# EAGLE schematic STM32F446 front pane - northeast - v3 (EAGLE 9.6.2)

## Sheet 1 of 3
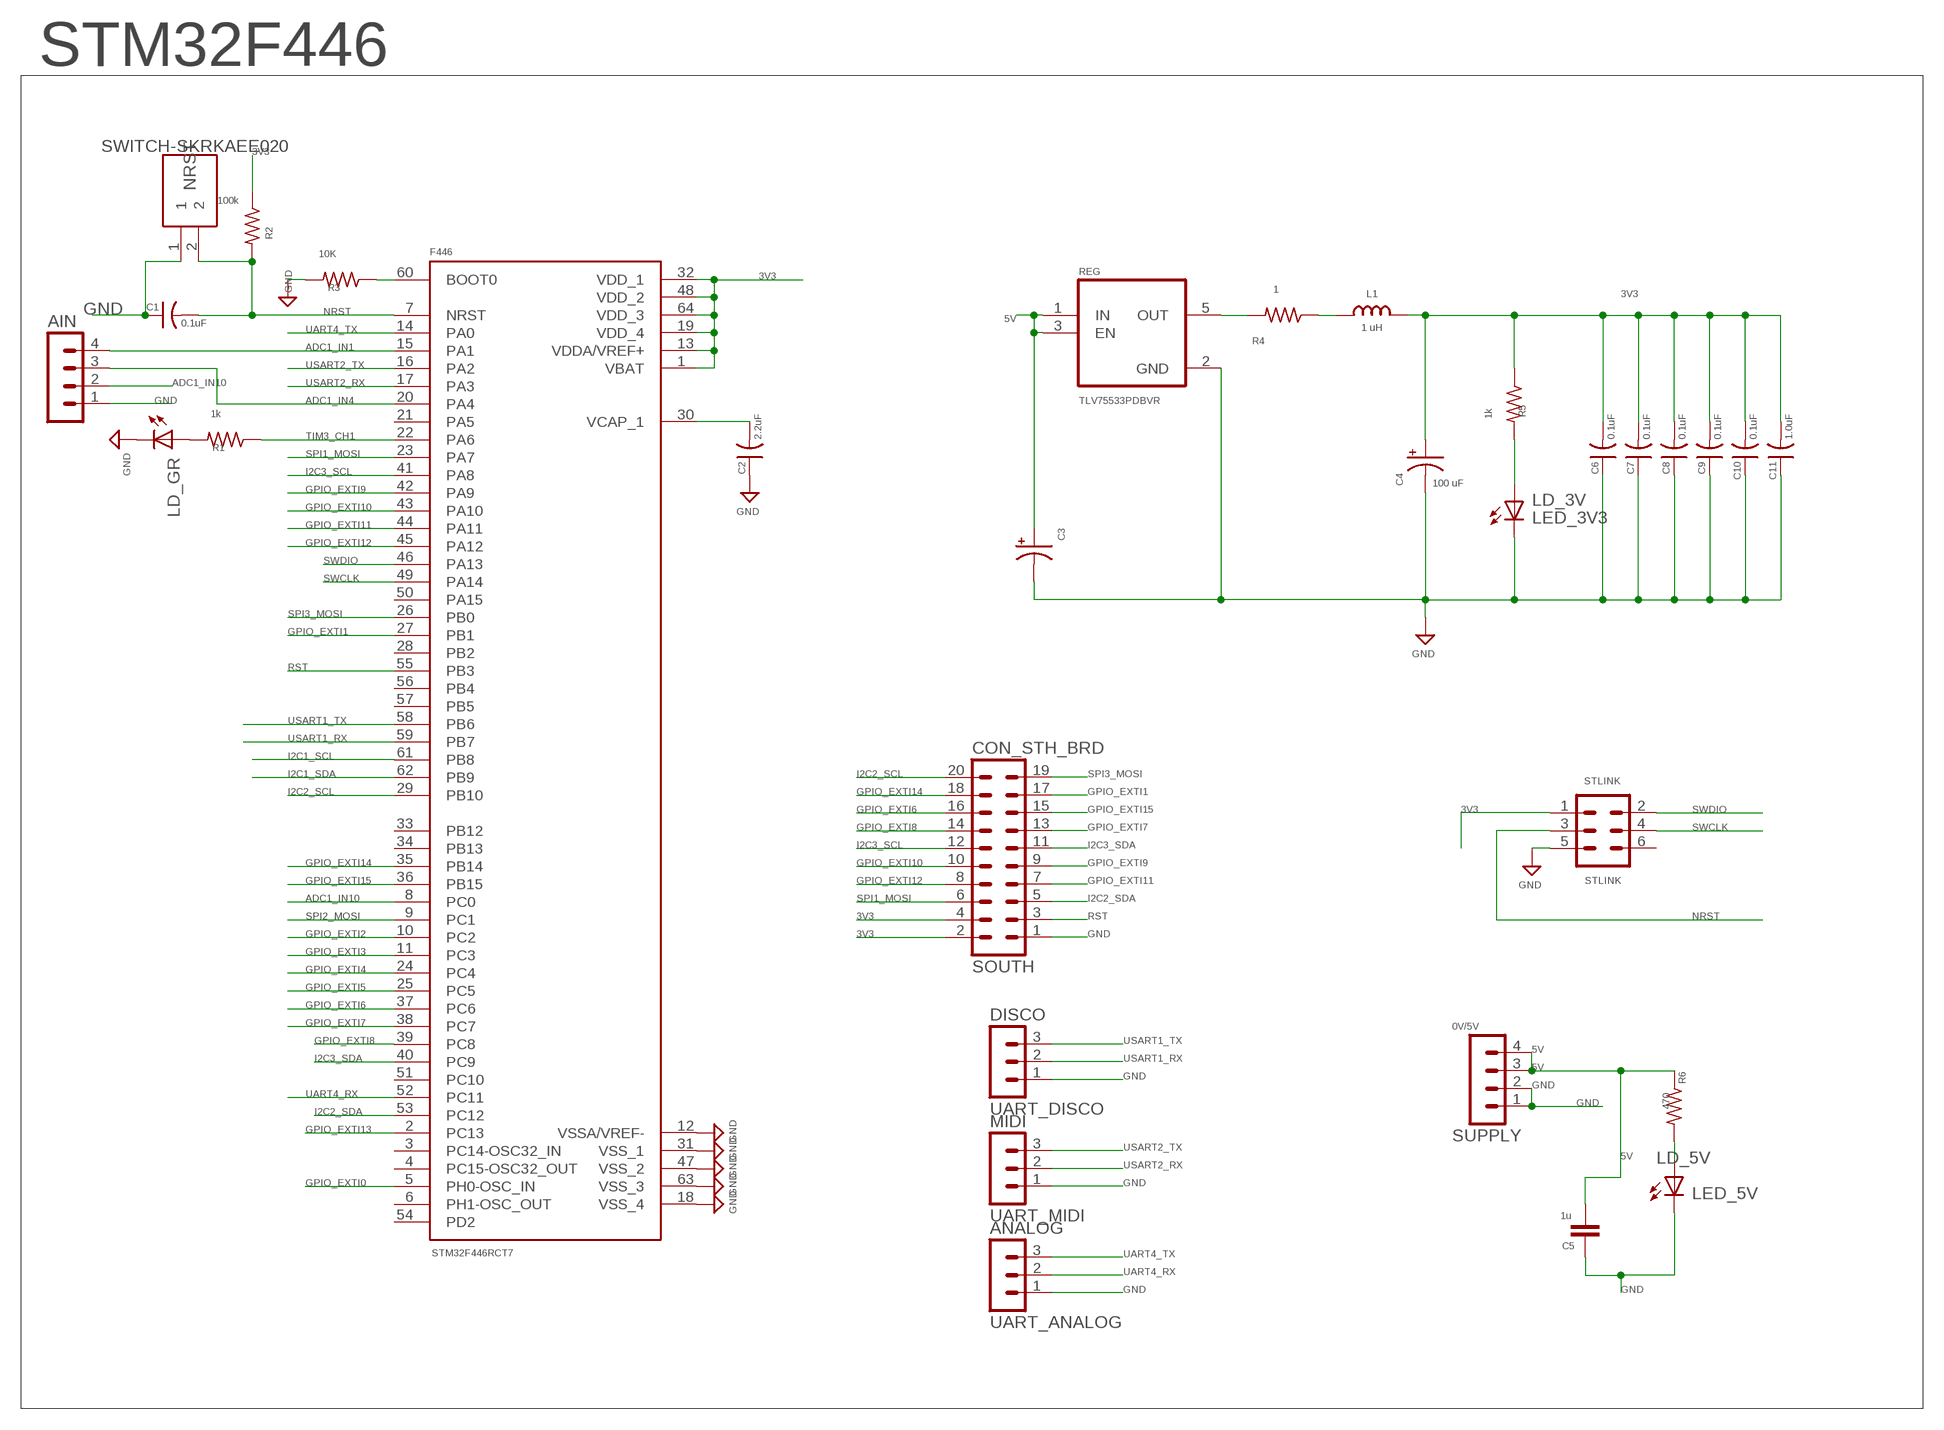
[diagram p0: schematic, sheet 1]

### Parts
0V/5V  SUPPLY  PINHEADER-M04PL  [MA04-1]
AIN  MA04-1  [MA04-1]
ANALOG  UART_ANALOG  MA03-1  [MA03-1]
C1  0.1uF  C-US0805  [C0805]
C2  2.2uF  C-US0805  [C0805]
C3  10u  CPOL-US2917  [CPOL2917]
C4  100 uF  CPOL-US2917  [CPOL2917]
C5  1u  C-EUC1206  [C1206]
C6  0.1uF  C-US0805  [C0805]
C7  0.1uF  C-US0805  [C0805]
C8  0.1uF  C-US0805  [C0805]
C9  0.1uF  C-US0805  [C0805]
C10  0.1uF  C-US0805  [C0805]
C11  1.0uF  C-US0805  [C0805]
CON_STH_BRD  SOUTH  MA10-2  [MA10-2]
DISCO  UART_DISCO  MA03-1  [MA03-1]
F446  STM32F446RCT7  [QFP50P1200X1200X160-64N]
L1  1 uH  L-USL0805  [L0805]
LD_3V  LED_3V3  LED-0805  [0805-LED]
LD_5V  LED_5V  LED-0603  [0603-LED]
LD_GR  LED-0805  [0805-LED]
MIDI  UART_MIDI  MA03-1  [MA03-1]
NRST  SWITCH-SKRKAEE020  [SKRKAEE020]
R1  1k  R-US0805  [R0805]
R2  100k  R-US0805  [R0805]
R3  10K  R-US0805  [R0805]
R4  1  R-US0805  [R0805]
R5  1k  R-US0805  [R0805]
R6  470  R-US0805  [R0805]
REG  TLV75533PDBVR  [SOT95P280X145-5N]
STLINK  STLINK  MA03-2  [MA03-2]

### Nets
3V3: C4.+ C6.2 C7.2 C8.2 C9.2 C10.2 C11.2 CON_STH_BRD.2 CON_STH_BRD.4 F446.1(VBAT) F446.13(VDDA/VREF+) F446.19(VDD_4) F446.32(VDD_1) F446.48(VDD_2) F446.64(VDD_3) L1.2 R2.1 R5.1 STLINK.1 ; also sheet 2,3
5V: 0V/5V.3 0V/5V.4 C3.+ C5.2 R6.1 REG.1(IN) REG.3(EN)
ADC1_IN1: AIN.4 F446.15(PA1)
ADC1_IN4: AIN.3 F446.20(PA4)
ADC1_IN10: AIN.2 F446.8(PC0)
BOOT1: F446.60(BOOT0) R3.1
GND: 0V/5V.1 0V/5V.2 AIN.1 ANALOG.1 C1.1 C2.1 C3.- C4.- C5.1 C6.1 C7.1 C8.1 C9.1 C10.1 C11.1 CON_STH_BRD.1 DISCO.1 F446.12(VSSA/VREF-) F446.18(VSS_4) F446.31(VSS_1) F446.47(VSS_2) F446.63(VSS_3) LD_3V.C LD_5V.C LD_GR.C MIDI.1 NRST.1 R3.2 REG.2(GND) STLINK.5 ; also sheet 2,3
GPIO_EXTI0: F446.5(PH0-OSC_IN) ; also sheet 3
GPIO_EXTI1: CON_STH_BRD.17 F446.27(PB1)
GPIO_EXTI2: F446.10(PC2) ; also sheet 3
GPIO_EXTI3: F446.11(PC3) ; also sheet 3
GPIO_EXTI4: F446.24(PC4) ; also sheet 2
GPIO_EXTI5: F446.25(PC5) ; also sheet 2
GPIO_EXTI6: CON_STH_BRD.16 F446.37(PC6)
GPIO_EXTI7: CON_STH_BRD.13 F446.38(PC7)
GPIO_EXTI8: CON_STH_BRD.14 F446.39(PC8)
GPIO_EXTI9: CON_STH_BRD.9 F446.42(PA9)
GPIO_EXTI10: CON_STH_BRD.10 F446.43(PA10)
GPIO_EXTI11: CON_STH_BRD.7 F446.44(PA11)
GPIO_EXTI12: CON_STH_BRD.8 F446.45(PA12)
GPIO_EXTI13: F446.2(PC13) ; also sheet 3
GPIO_EXTI14: CON_STH_BRD.18 F446.35(PB14)
GPIO_EXTI15: CON_STH_BRD.15 F446.36(PB15)
I2C1_SCL: F446.61(PB8) ; also sheet 2,3
I2C1_SDA: F446.62(PB9) ; also sheet 2,3
I2C2_SCL: CON_STH_BRD.20 F446.29(PB10)
I2C2_SDA: CON_STH_BRD.5 F446.53(PC12)
I2C3_SCL: CON_STH_BRD.12 F446.41(PA8)
I2C3_SDA: CON_STH_BRD.11 F446.40(PC9)
N$53: LD_5V.A R6.2
N$56: LD_GR.A R1.2
N$57: LD_3V.A R5.2
N$108: R4.2 REG.5(OUT)
N$109: L1.1 R4.1
NRST: C1.2 F446.7(NRST) NRST.2 R2.2 STLINK.3
RST: CON_STH_BRD.3 F446.55(PB3) ; also sheet 2,3
SPI1_MOSI: CON_STH_BRD.6 F446.23(PA7)
SPI2_MOSI: F446.9(PC1) ; also sheet 2
SPI3_MOSI: CON_STH_BRD.19 F446.26(PB0)
SWCLK: F446.49(PA14) STLINK.4
SWDIO: F446.46(PA13) STLINK.2
TIM3_CH1: F446.22(PA6) R1.1
UART4_RX: ANALOG.2 F446.52(PC11)
UART4_TX: ANALOG.3 F446.14(PA0)
USART1_RX: DISCO.2 F446.59(PB7)
USART1_TX: DISCO.3 F446.58(PB6)
USART2_RX: F446.17(PA3) MIDI.2
USART2_TX: F446.16(PA2) MIDI.3
VCAP1: C2.2 F446.30(VCAP_1)
Unconnected: F446.3(PC14-OSC32_IN) F446.4(PC15-OSC32_OUT) F446.6(PH1-OSC_OUT) F446.21(PA5) F446.28(PB2) F446.33(PB12) F446.34(PB13) F446.50(PA15) F446.51(PC10) F446.54(PD2) F446.56(PB4) F446.57(PB5) STLINK.6

### Notes on the sheet
- STM32F446

## Sheet 2 of 3
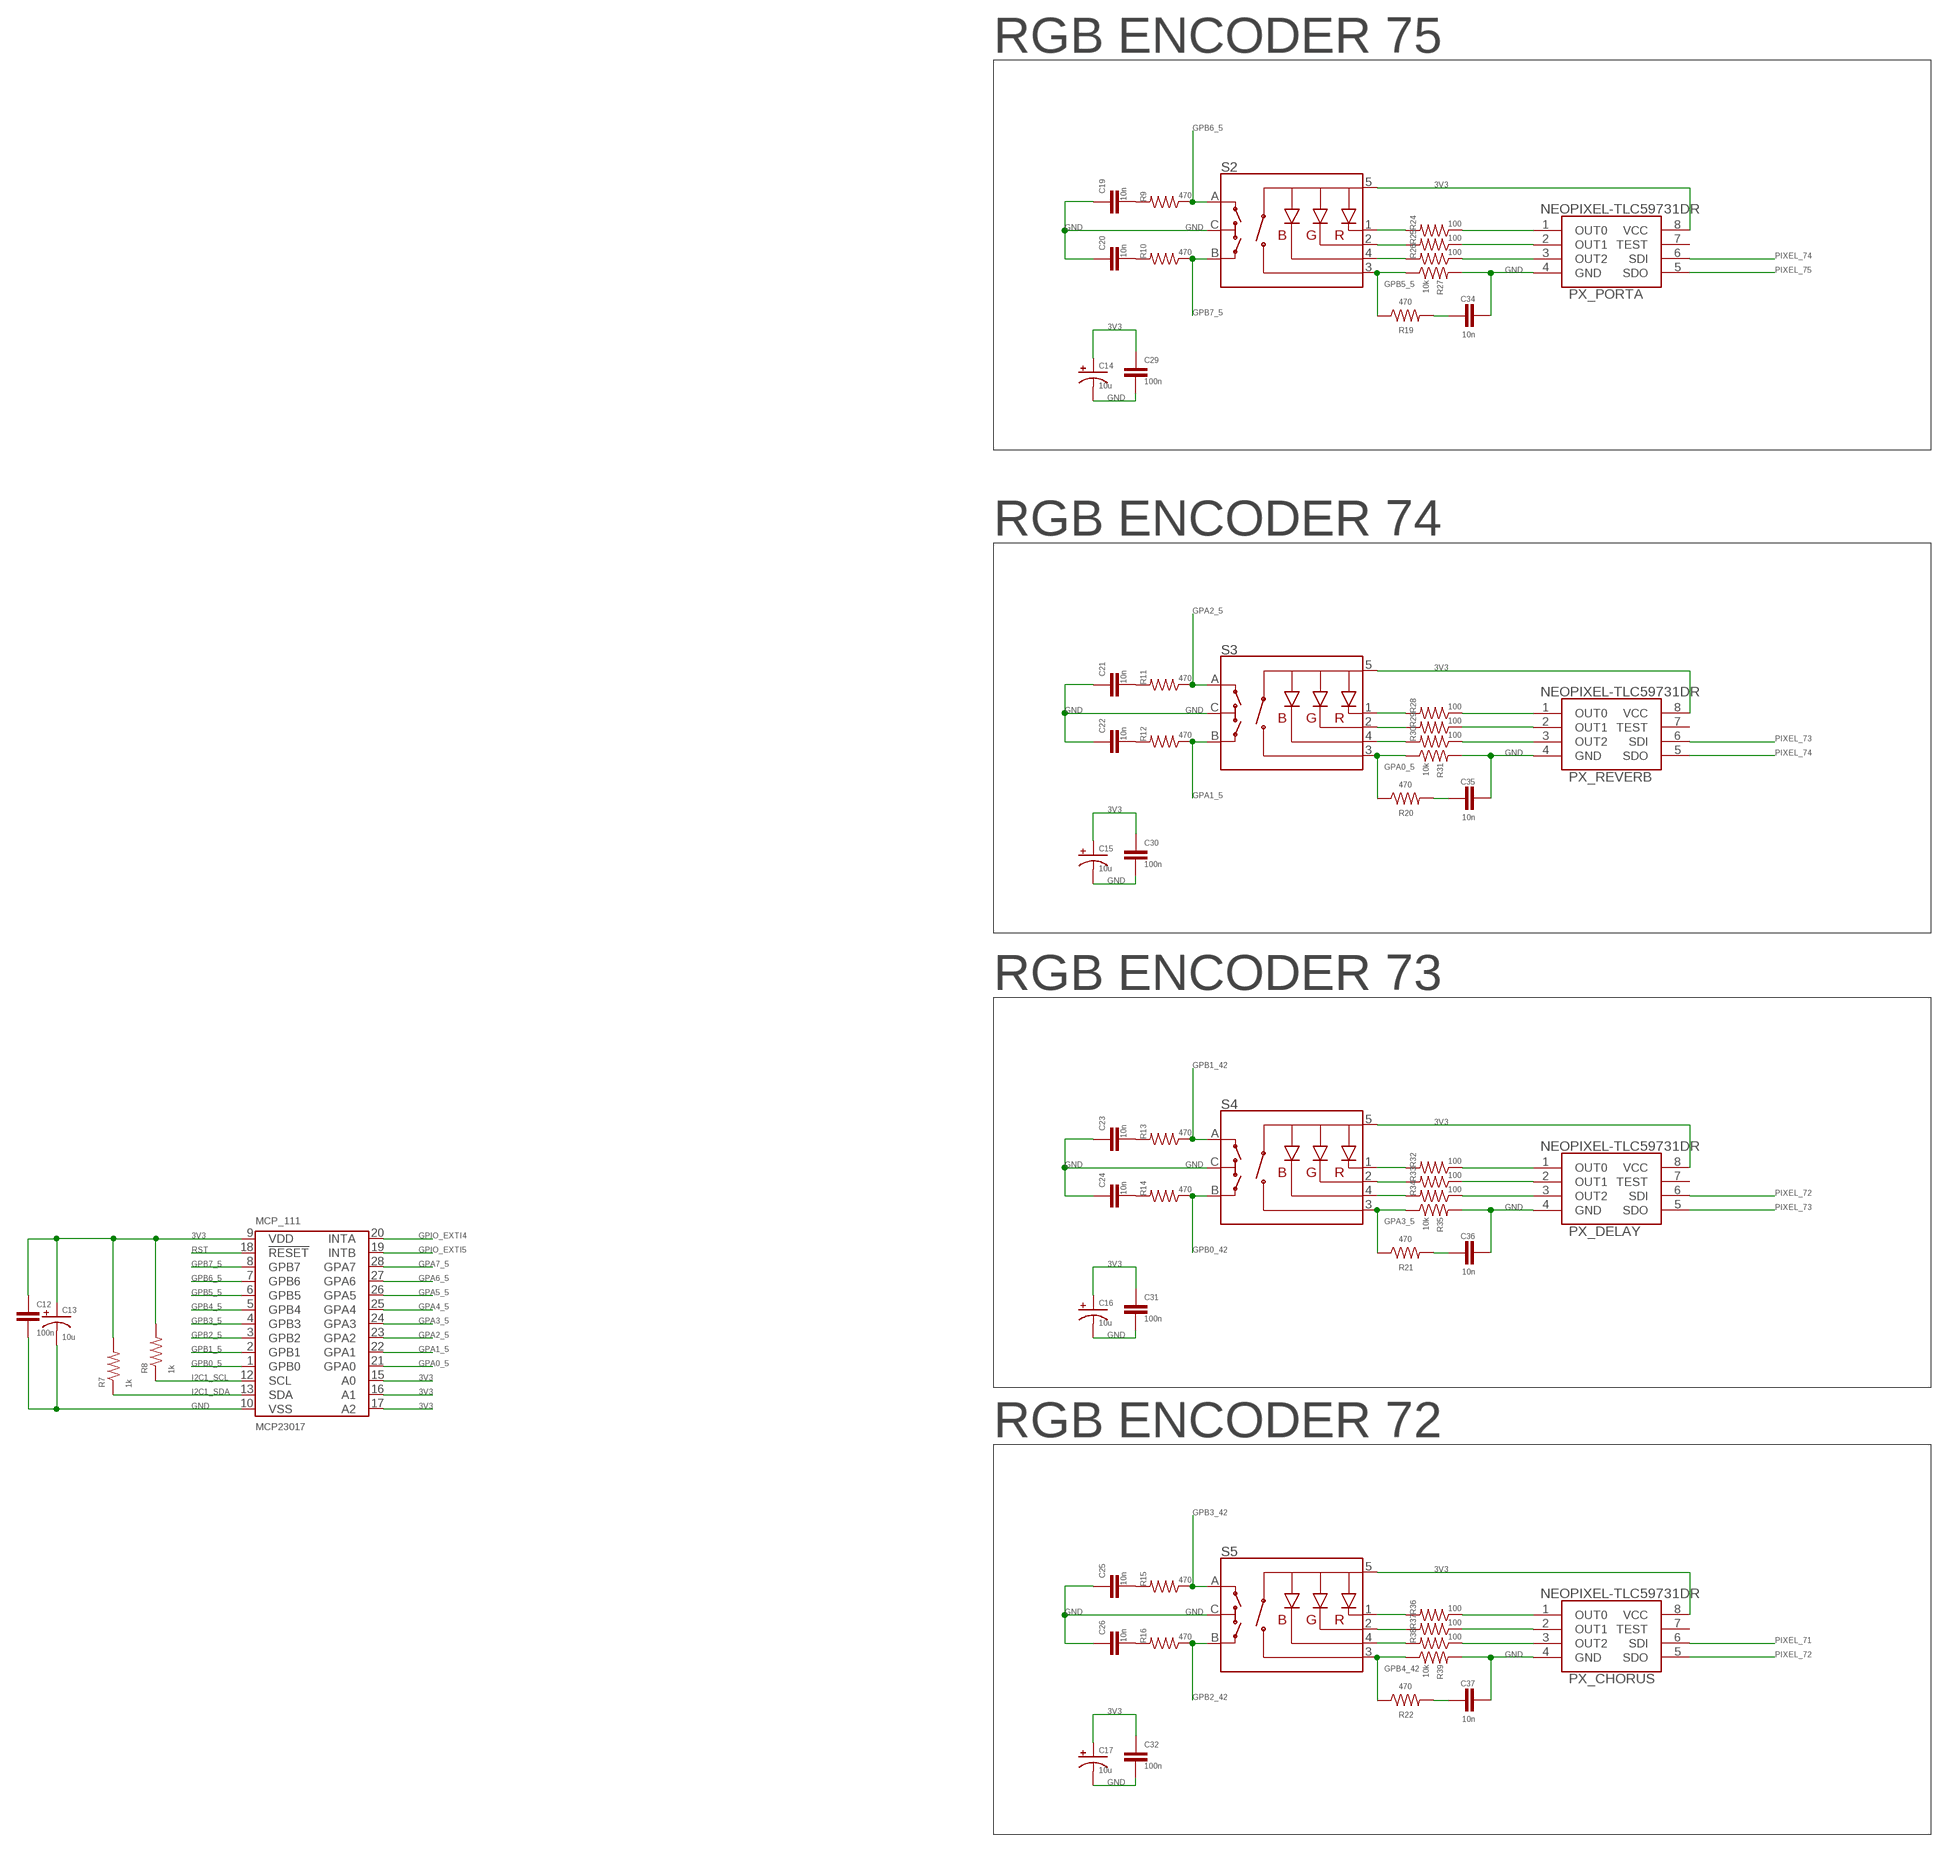
[diagram p1: schematic, sheet 2, part 1 of 2]
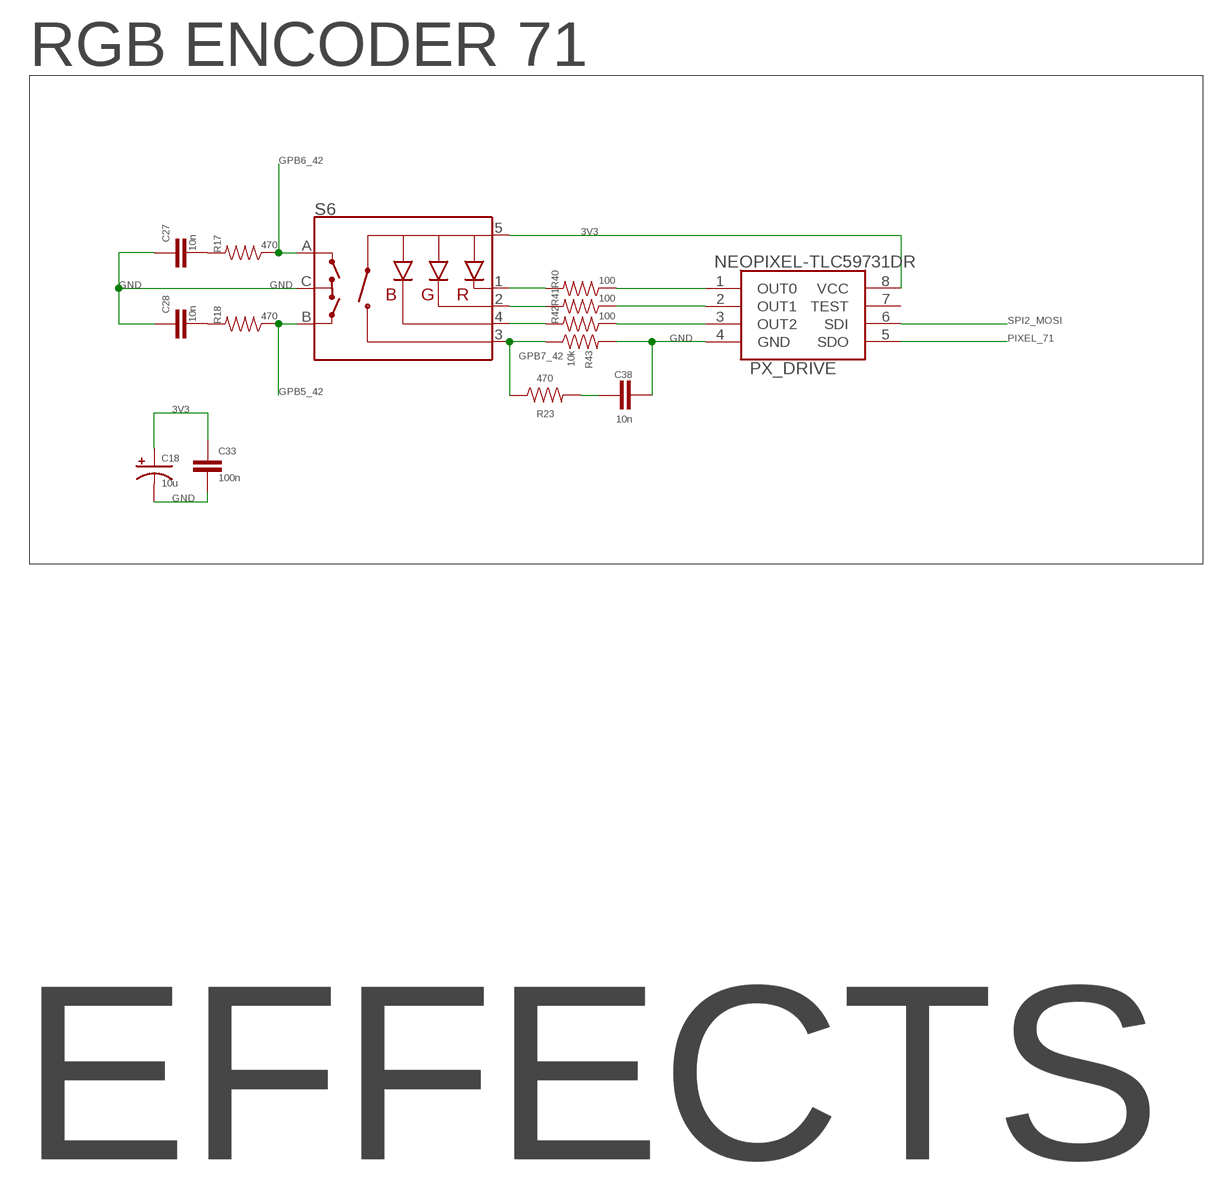
[diagram p2: schematic, sheet 2, part 2 of 2]

### Parts
C12  100n  PASSIF-CAP-0805  [0805-CAP]
C13  10u  PASSIF-CPOL-US2917  [CPOL2917]
C14  10u  PASSIF-CPOL-US2917  [CPOL2917]
C15  10u  PASSIF-CPOL-US2917  [CPOL2917]
C16  10u  PASSIF-CPOL-US2917  [CPOL2917]
C17  10u  PASSIF-CPOL-US2917  [CPOL2917]
C18  10u  PASSIF-CPOL-US2917  [CPOL2917]
C19  10n  PASSIF-CAP-0805  [0805-CAP]
C20  10n  PASSIF-CAP-0805  [0805-CAP]
C21  10n  PASSIF-CAP-0805  [0805-CAP]
C22  10n  PASSIF-CAP-0805  [0805-CAP]
C23  10n  PASSIF-CAP-0805  [0805-CAP]
C24  10n  PASSIF-CAP-0805  [0805-CAP]
C25  10n  PASSIF-CAP-0805  [0805-CAP]
C26  10n  PASSIF-CAP-0805  [0805-CAP]
C27  10n  PASSIF-CAP-0805  [0805-CAP]
C28  10n  PASSIF-CAP-0805  [0805-CAP]
C29  100n  PASSIF-CAP-0805  [0805-CAP]
C30  100n  PASSIF-CAP-0805  [0805-CAP]
C31  100n  PASSIF-CAP-0805  [0805-CAP]
C32  100n  PASSIF-CAP-0805  [0805-CAP]
C33  100n  PASSIF-CAP-0805  [0805-CAP]
C34  10n  PASSIF-CAP-0805  [0805-CAP]
C35  10n  PASSIF-CAP-0805  [0805-CAP]
C36  10n  PASSIF-CAP-0805  [0805-CAP]
C37  10n  PASSIF-CAP-0805  [0805-CAP]
C38  10n  PASSIF-CAP-0805  [0805-CAP]
MCP_111  MCP23017  [SOIC-28]
PX_CHORUS  NEOPIXEL-TLC59731DR  [SOIC127P600X175-8N]
PX_DELAY  NEOPIXEL-TLC59731DR  [SOIC127P600X175-8N]
PX_DRIVE  NEOPIXEL-TLC59731DR  [SOIC127P600X175-8N]
PX_PORTA  NEOPIXEL-TLC59731DR  [SOIC127P600X175-8N]
PX_REVERB  NEOPIXEL-TLC59731DR  [SOIC127P600X175-8N]
R7  1k  R-US_R0805  [R0805]
R8  1k  R-US_R0805  [R0805]
R9  470  PASSIF-RESISTOR-1206  [1206]
R10  470  PASSIF-RESISTOR-1206  [1206]
R11  470  PASSIF-RESISTOR-1206  [1206]
R12  470  PASSIF-RESISTOR-1206  [1206]
R13  470  PASSIF-RESISTOR-1206  [1206]
R14  470  PASSIF-RESISTOR-1206  [1206]
R15  470  PASSIF-RESISTOR-1206  [1206]
R16  470  PASSIF-RESISTOR-1206  [1206]
R17  470  PASSIF-RESISTOR-1206  [1206]
R18  470  PASSIF-RESISTOR-1206  [1206]
R19  470  PASSIF-RESISTOR-1206  [1206]
R20  470  PASSIF-RESISTOR-1206  [1206]
R21  470  PASSIF-RESISTOR-1206  [1206]
R22  470  PASSIF-RESISTOR-1206  [1206]
R23  470  PASSIF-RESISTOR-1206  [1206]
R24  100  PASSIF-RESISTOR-1206  [1206]
R25  100  PASSIF-RESISTOR-1206  [1206]
R26  100  PASSIF-RESISTOR-1206  [1206]
R27  10k  PASSIF-RESISTOR-1206  [1206]
R28  100  PASSIF-RESISTOR-1206  [1206]
R29  100  PASSIF-RESISTOR-1206  [1206]
R30  100  PASSIF-RESISTOR-1206  [1206]
R31  10k  PASSIF-RESISTOR-1206  [1206]
R32  100  PASSIF-RESISTOR-1206  [1206]
R33  100  PASSIF-RESISTOR-1206  [1206]
R34  100  PASSIF-RESISTOR-1206  [1206]
R35  10k  PASSIF-RESISTOR-1206  [1206]
R36  100  PASSIF-RESISTOR-1206  [1206]
R37  100  PASSIF-RESISTOR-1206  [1206]
R38  100  PASSIF-RESISTOR-1206  [1206]
R39  10k  PASSIF-RESISTOR-1206  [1206]
R40  100  PASSIF-RESISTOR-1206  [1206]
R41  100  PASSIF-RESISTOR-1206  [1206]
R42  100  PASSIF-RESISTOR-1206  [1206]
R43  10k  PASSIF-RESISTOR-1206  [1206]
S2  ENCODER-RGB-SWITCH-NO_NUT  [ENCODER_LED_3]
S3  ENCODER-RGB-SWITCH-NO_NUT  [ENCODER_LED_3]
S4  ENCODER-RGB-SWITCH-NO_NUT  [ENCODER_LED_3]
S5  ENCODER-RGB-SWITCH-NO_NUT  [ENCODER_LED_3]
S6  ENCODER-RGB-SWITCH-NO_NUT  [ENCODER_LED_3]

### Nets
3V3: C12.1 C13.+ C14.+ C15.+ C16.+ C17.+ C18.+ C29.1 C30.1 C31.1 C32.1 C33.1 MCP_111.9(VDD) MCP_111.15(A0) MCP_111.16(A1) MCP_111.17(A2) PX_CHORUS.8(VCC) PX_DELAY.8(VCC) PX_DRIVE.8(VCC) PX_PORTA.8(VCC) PX_REVERB.8(VCC) R7.2 R8.2 S2.5(+) S3.5(+) S4.5(+) S5.5(+) S6.5(+) ; also sheet 1,3
GND: C12.2 C13.- C14.- C15.- C16.- C17.- C18.- C19.1 C20.1 C21.1 C22.1 C23.1 C24.1 C25.1 C26.1 C27.1 C28.1 C29.2 C30.2 C31.2 C32.2 C33.2 C34.2 C35.2 C36.2 C37.2 C38.2 MCP_111.10(VSS) PX_CHORUS.4(GND) PX_DELAY.4(GND) PX_DRIVE.4(GND) PX_PORTA.4(GND) PX_REVERB.4(GND) R27.2 R31.2 R35.2 R39.2 R43.2 S2.C S3.C S4.C S5.C S6.C ; also sheet 1,3
GPA0_5: MCP_111.21(GPA0) R20.1 R31.1 S3.3(SW)
GPA1_5: MCP_111.22(GPA1) R12.1 S3.B
GPA2_5: MCP_111.23(GPA2) R11.1 S3.A
GPA3_5: MCP_111.24(GPA3) R21.1 R35.1 S4.3(SW)
GPA4_5: MCP_111.25(GPA4) ; also sheet 3
GPA5_5: MCP_111.26(GPA5) ; also sheet 3
GPA6_5: MCP_111.27(GPA6) ; also sheet 3
GPA7_5: MCP_111.28(GPA7) ; also sheet 3
GPB0_5: MCP_111.1(GPB0) ; also sheet 3
GPB0_42: R14.1 S4.B ; also sheet 3
GPB1_5: MCP_111.2(GPB1) ; also sheet 3
GPB1_42: R13.1 S4.A ; also sheet 3
GPB2_5: MCP_111.3(GPB2) ; also sheet 3
GPB2_42: R16.1 S5.B ; also sheet 3
GPB3_5: MCP_111.4(GPB3) ; also sheet 3
GPB3_42: R15.1 S5.A ; also sheet 3
GPB4_5: MCP_111.5(GPB4) ; also sheet 3
GPB4_42: R22.1 R39.1 S5.3(SW) ; also sheet 3
GPB5_5: MCP_111.6(GPB5) R19.1 R27.1 S2.3(SW)
GPB5_42: R18.1 S6.B ; also sheet 3
GPB6_5: MCP_111.7(GPB6) R9.1 S2.A
GPB6_42: R17.1 S6.A ; also sheet 3
GPB7_5: MCP_111.8(GPB7) R10.1 S2.B
GPB7_42: R23.1 R43.1 S6.3(SW) ; also sheet 3
GPIO_EXTI4: MCP_111.20(INTA) ; also sheet 1
GPIO_EXTI5: MCP_111.19(INTB) ; also sheet 1
I2C1_SCL: MCP_111.12(SCL) R8.1 ; also sheet 1,3
I2C1_SDA: MCP_111.13(SDA) R7.1 ; also sheet 1,3
N$5416: R40.2 S6.1(-R)
N$5417: R41.2 S6.2(-G)
N$5418: R42.2 S6.4(-B)
N$5419: PX_DRIVE.1(OUT0) R40.1
N$5420: PX_DRIVE.2(OUT1) R41.1
N$5421: PX_DRIVE.3(OUT2) R42.1
N$5422: C27.2 R17.2
N$5423: C28.2 R18.2
N$5424: C38.1 R23.2
N$6880: R36.2 S5.1(-R)
N$6881: R37.2 S5.2(-G)
N$6882: R38.2 S5.4(-B)
N$6883: PX_CHORUS.1(OUT0) R36.1
N$6884: PX_CHORUS.2(OUT1) R37.1
N$6885: PX_CHORUS.3(OUT2) R38.1
N$6886: C25.2 R15.2
N$6887: C26.2 R16.2
N$6888: C37.1 R22.2
N$8344: R32.2 S4.1(-R)
N$8345: R33.2 S4.2(-G)
N$8346: R34.2 S4.4(-B)
N$8347: PX_DELAY.1(OUT0) R32.1
N$8348: PX_DELAY.2(OUT1) R33.1
N$8349: PX_DELAY.3(OUT2) R34.1
N$8350: C23.2 R13.2
N$8351: C24.2 R14.2
N$8352: C36.1 R21.2
N$9076: R28.2 S3.1(-R)
N$9077: R29.2 S3.2(-G)
N$9078: R30.2 S3.4(-B)
N$9079: PX_REVERB.1(OUT0) R28.1
N$9080: PX_REVERB.2(OUT1) R29.1
N$9081: PX_REVERB.3(OUT2) R30.1
N$9082: C21.2 R11.2
N$9083: C22.2 R12.2
N$9084: C35.1 R20.2
N$9442: R24.2 S2.1(-R)
N$9443: R25.2 S2.2(-G)
N$9444: R26.2 S2.4(-B)
N$9445: PX_PORTA.1(OUT0) R24.1
N$9446: PX_PORTA.2(OUT1) R25.1
N$9447: PX_PORTA.3(OUT2) R26.1
N$9448: C19.2 R9.2
N$9449: C20.2 R10.2
N$9450: C34.1 R19.2
PIXEL_71: PX_CHORUS.6(SDI) PX_DRIVE.5(SDO)
PIXEL_72: PX_CHORUS.5(SDO) PX_DELAY.6(SDI)
PIXEL_73: PX_DELAY.5(SDO) PX_REVERB.6(SDI)
PIXEL_74: PX_PORTA.6(SDI) PX_REVERB.5(SDO)
PIXEL_75: PX_PORTA.5(SDO) ; also sheet 3
RST: MCP_111.18(!RESET) ; also sheet 1,3
SPI2_MOSI: PX_DRIVE.6(SDI) ; also sheet 1
Unconnected: PX_CHORUS.7(TEST) PX_DELAY.7(TEST) PX_DRIVE.7(TEST) PX_PORTA.7(TEST) PX_REVERB.7(TEST)

### Notes on the sheet
- RGB ENCODER 75
- RGB ENCODER 74
- RGB ENCODER 73
- RGB ENCODER 72
- RGB ENCODER 71
- EFFECTS

## Sheet 3 of 3
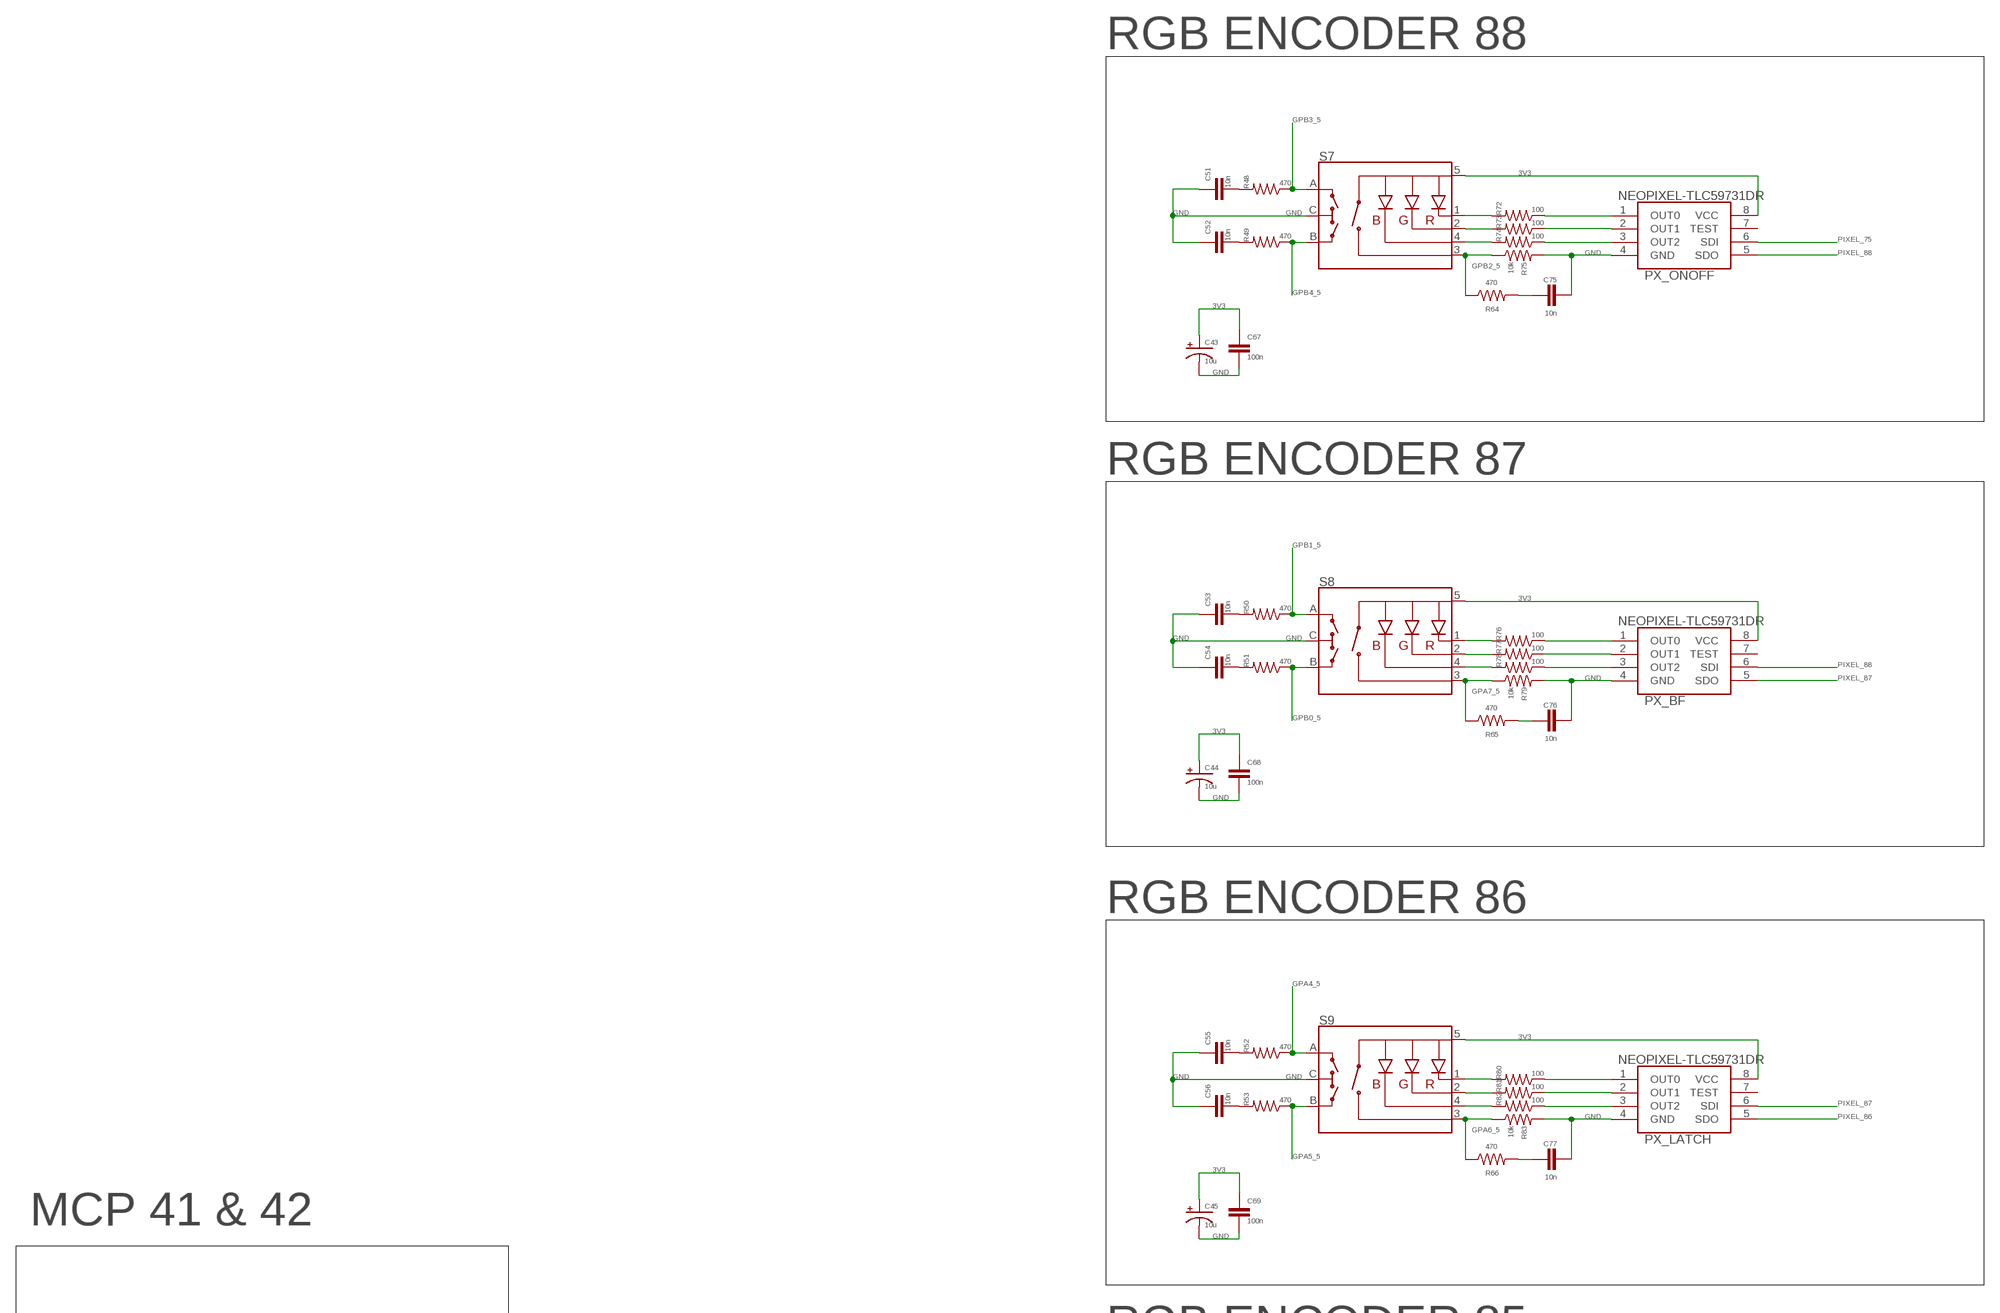
[diagram p3: schematic, sheet 3, part 1 of 2]
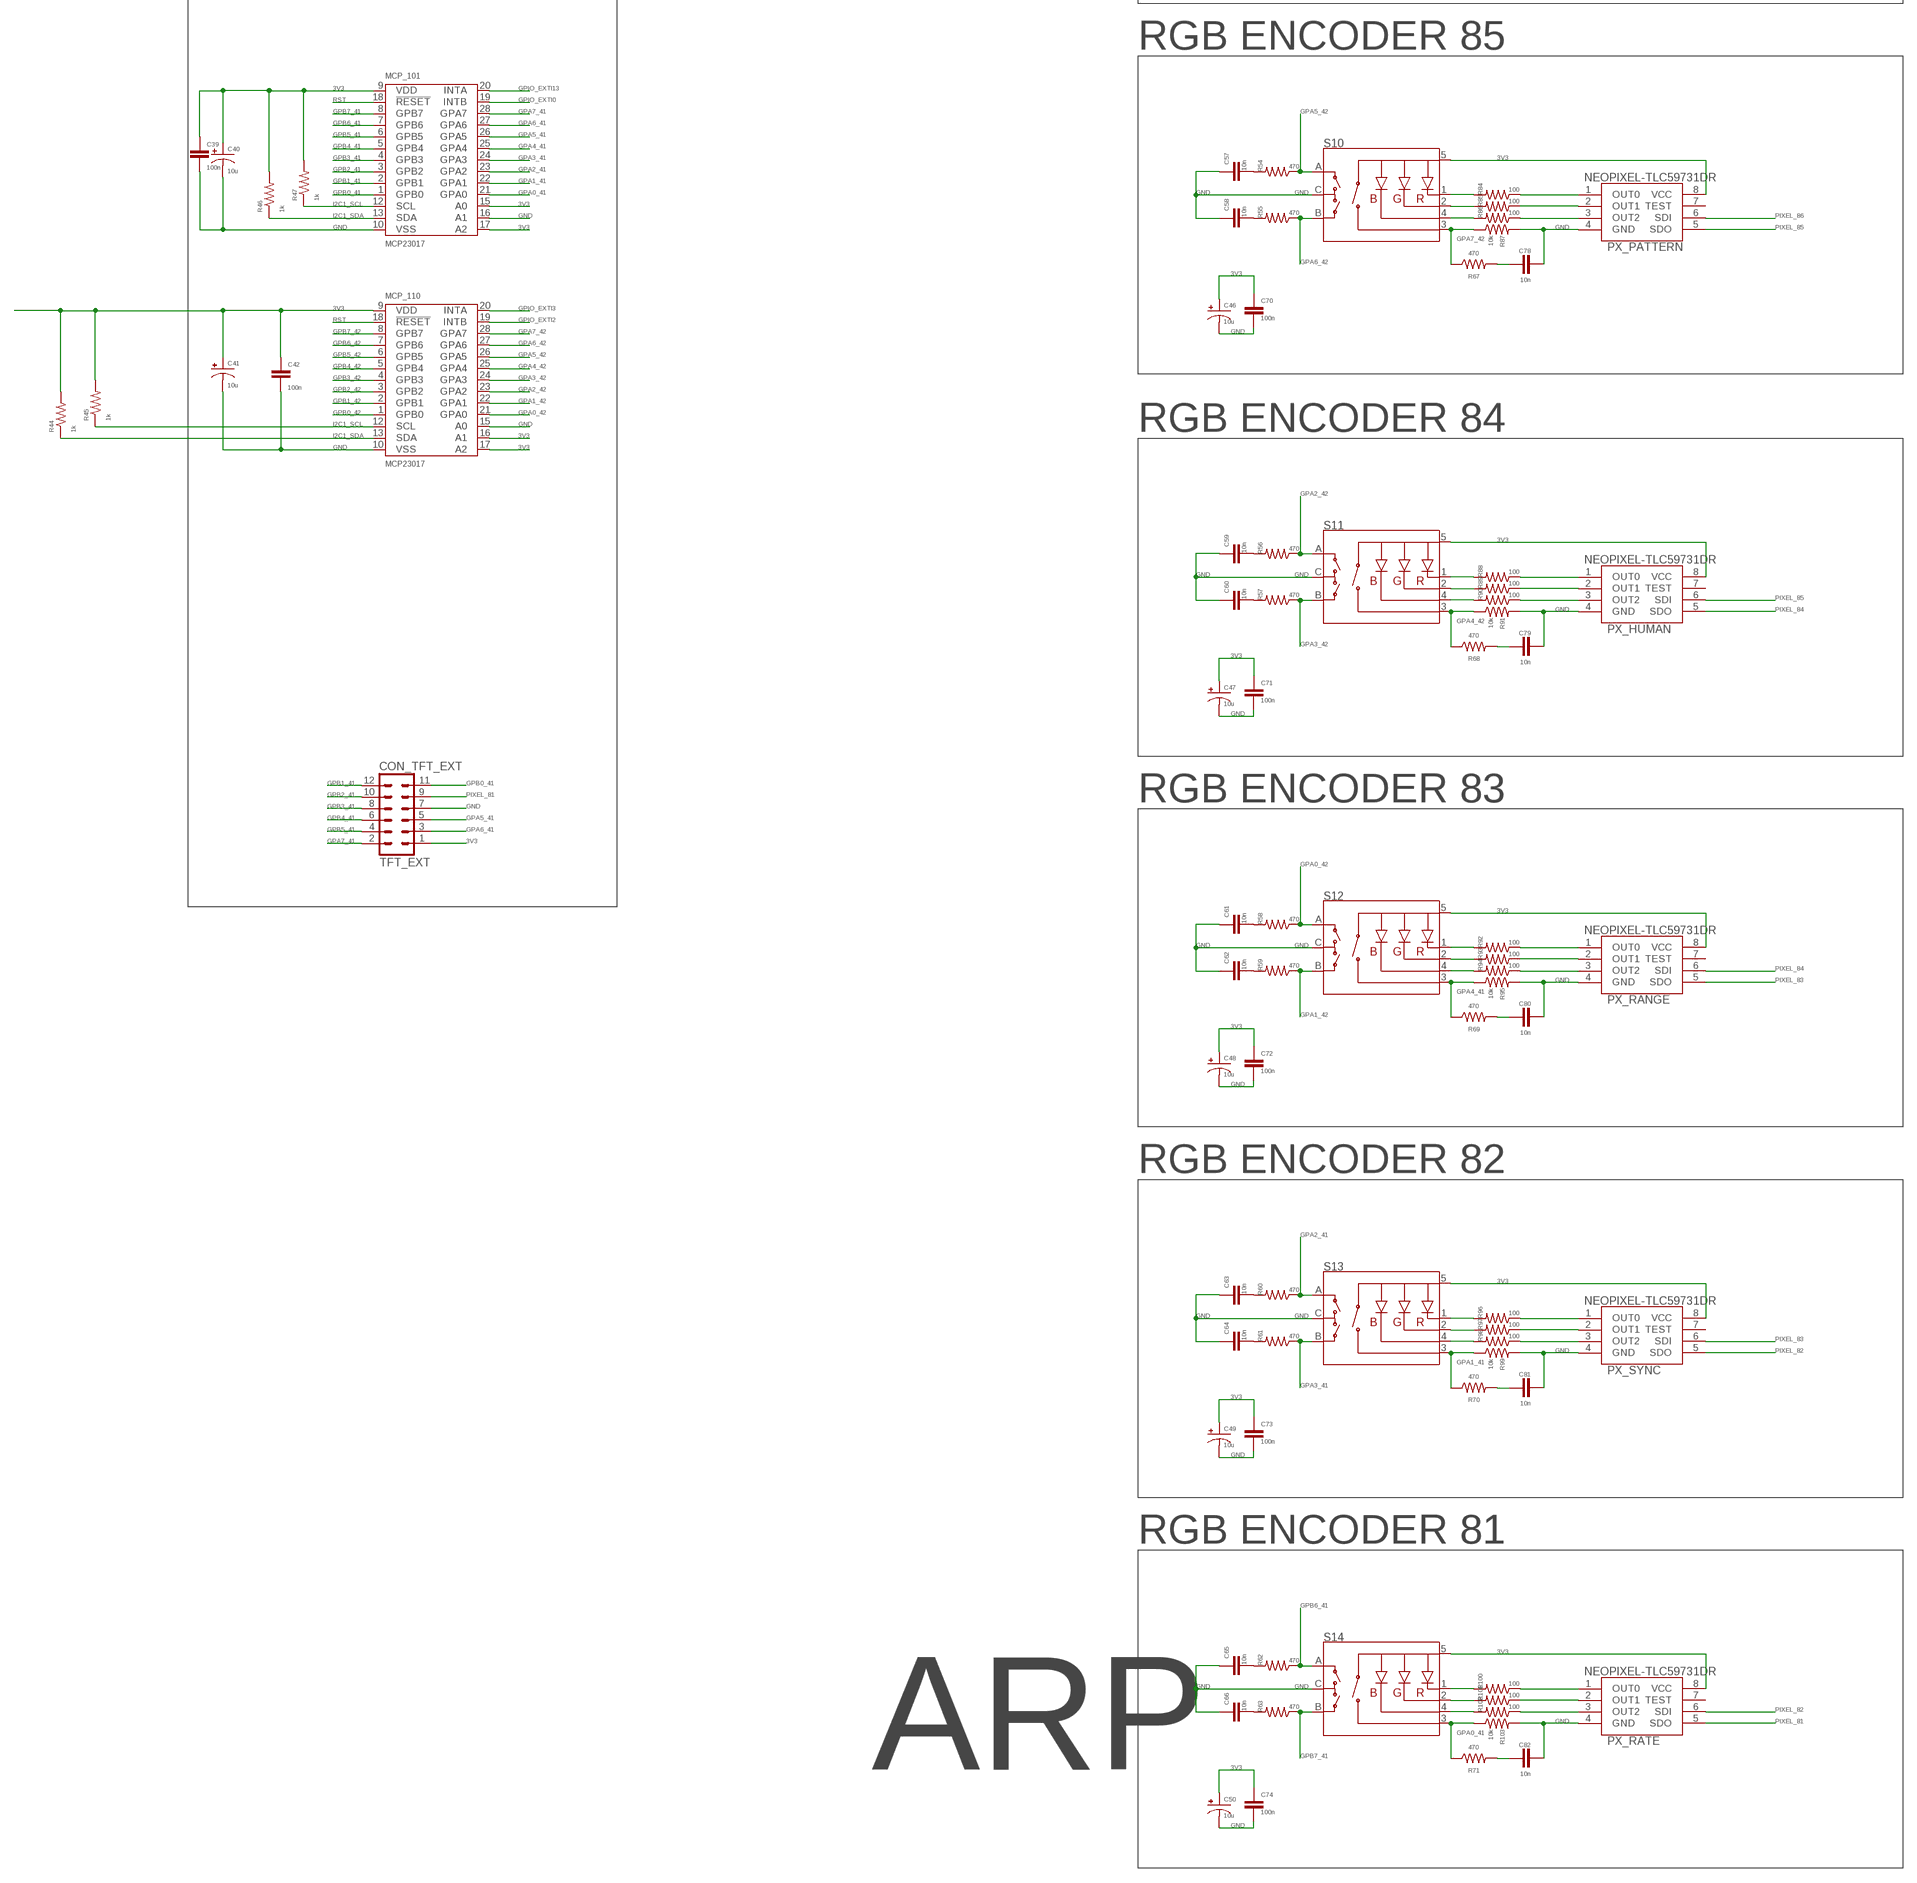
[diagram p4: schematic, sheet 3, part 2 of 2]

### Parts
C39  100n  PASSIF-CAP-0805  [0805-CAP]
C40  10u  PASSIF-CPOL-US2917  [CPOL2917]
C41  10u  PASSIF-CPOL-US2917  [CPOL2917]
C42  100n  PASSIF-CAP-0805  [0805-CAP]
C43  10u  PASSIF-CPOL-US2917  [CPOL2917]
C44  10u  PASSIF-CPOL-US2917  [CPOL2917]
C45  10u  PASSIF-CPOL-US2917  [CPOL2917]
C46  10u  PASSIF-CPOL-US2917  [CPOL2917]
C47  10u  PASSIF-CPOL-US2917  [CPOL2917]
C48  10u  PASSIF-CPOL-US2917  [CPOL2917]
C49  10u  PASSIF-CPOL-US2917  [CPOL2917]
C50  10u  PASSIF-CPOL-US2917  [CPOL2917]
C51  10n  PASSIF-CAP-0805  [0805-CAP]
C52  10n  PASSIF-CAP-0805  [0805-CAP]
C53  10n  PASSIF-CAP-0805  [0805-CAP]
C54  10n  PASSIF-CAP-0805  [0805-CAP]
C55  10n  PASSIF-CAP-0805  [0805-CAP]
C56  10n  PASSIF-CAP-0805  [0805-CAP]
C57  10n  PASSIF-CAP-0805  [0805-CAP]
C58  10n  PASSIF-CAP-0805  [0805-CAP]
C59  10n  PASSIF-CAP-0805  [0805-CAP]
C60  10n  PASSIF-CAP-0805  [0805-CAP]
C61  10n  PASSIF-CAP-0805  [0805-CAP]
C62  10n  PASSIF-CAP-0805  [0805-CAP]
C63  10n  PASSIF-CAP-0805  [0805-CAP]
C64  10n  PASSIF-CAP-0805  [0805-CAP]
C65  10n  PASSIF-CAP-0805  [0805-CAP]
C66  10n  PASSIF-CAP-0805  [0805-CAP]
C67  100n  PASSIF-CAP-0805  [0805-CAP]
C68  100n  PASSIF-CAP-0805  [0805-CAP]
C69  100n  PASSIF-CAP-0805  [0805-CAP]
C70  100n  PASSIF-CAP-0805  [0805-CAP]
C71  100n  PASSIF-CAP-0805  [0805-CAP]
C72  100n  PASSIF-CAP-0805  [0805-CAP]
C73  100n  PASSIF-CAP-0805  [0805-CAP]
C74  100n  PASSIF-CAP-0805  [0805-CAP]
C75  10n  PASSIF-CAP-0805  [0805-CAP]
C76  10n  PASSIF-CAP-0805  [0805-CAP]
C77  10n  PASSIF-CAP-0805  [0805-CAP]
C78  10n  PASSIF-CAP-0805  [0805-CAP]
C79  10n  PASSIF-CAP-0805  [0805-CAP]
C80  10n  PASSIF-CAP-0805  [0805-CAP]
C81  10n  PASSIF-CAP-0805  [0805-CAP]
C82  10n  PASSIF-CAP-0805  [0805-CAP]
CON_TFT_EXT  TFT_EXT  MA06-2  [MA06-2]
MCP_101  MCP23017  [SOIC-28]
MCP_110  MCP23017  [SOIC-28]
PX_BF  NEOPIXEL-TLC59731DR  [SOIC127P600X175-8N]
PX_HUMAN  NEOPIXEL-TLC59731DR  [SOIC127P600X175-8N]
PX_LATCH  NEOPIXEL-TLC59731DR  [SOIC127P600X175-8N]
PX_ONOFF  NEOPIXEL-TLC59731DR  [SOIC127P600X175-8N]
PX_PATTERN  NEOPIXEL-TLC59731DR  [SOIC127P600X175-8N]
PX_RANGE  NEOPIXEL-TLC59731DR  [SOIC127P600X175-8N]
PX_RATE  NEOPIXEL-TLC59731DR  [SOIC127P600X175-8N]
PX_SYNC  NEOPIXEL-TLC59731DR  [SOIC127P600X175-8N]
R44  1k  R-US_R0805  [R0805]
R45  1k  R-US_R0805  [R0805]
R46  1k  R-US_R0805  [R0805]
R47  1k  R-US_R0805  [R0805]
R48  470  PASSIF-RESISTOR-1206  [1206]
R49  470  PASSIF-RESISTOR-1206  [1206]
R50  470  PASSIF-RESISTOR-1206  [1206]
R51  470  PASSIF-RESISTOR-1206  [1206]
R52  470  PASSIF-RESISTOR-1206  [1206]
R53  470  PASSIF-RESISTOR-1206  [1206]
R54  470  PASSIF-RESISTOR-1206  [1206]
R55  470  PASSIF-RESISTOR-1206  [1206]
R56  470  PASSIF-RESISTOR-1206  [1206]
R57  470  PASSIF-RESISTOR-1206  [1206]
R58  470  PASSIF-RESISTOR-1206  [1206]
R59  470  PASSIF-RESISTOR-1206  [1206]
R60  470  PASSIF-RESISTOR-1206  [1206]
R61  470  PASSIF-RESISTOR-1206  [1206]
R62  470  PASSIF-RESISTOR-1206  [1206]
R63  470  PASSIF-RESISTOR-1206  [1206]
R64  470  PASSIF-RESISTOR-1206  [1206]
R65  470  PASSIF-RESISTOR-1206  [1206]
R66  470  PASSIF-RESISTOR-1206  [1206]
R67  470  PASSIF-RESISTOR-1206  [1206]
R68  470  PASSIF-RESISTOR-1206  [1206]
R69  470  PASSIF-RESISTOR-1206  [1206]
R70  470  PASSIF-RESISTOR-1206  [1206]
R71  470  PASSIF-RESISTOR-1206  [1206]
R72  100  PASSIF-RESISTOR-1206  [1206]
R73  100  PASSIF-RESISTOR-1206  [1206]
R74  100  PASSIF-RESISTOR-1206  [1206]
R75  10k  PASSIF-RESISTOR-1206  [1206]
R76  100  PASSIF-RESISTOR-1206  [1206]
R77  100  PASSIF-RESISTOR-1206  [1206]
R78  100  PASSIF-RESISTOR-1206  [1206]
R79  10k  PASSIF-RESISTOR-1206  [1206]
R80  100  PASSIF-RESISTOR-1206  [1206]
R81  100  PASSIF-RESISTOR-1206  [1206]
R82  100  PASSIF-RESISTOR-1206  [1206]
R83  10k  PASSIF-RESISTOR-1206  [1206]
R84  100  PASSIF-RESISTOR-1206  [1206]
R85  100  PASSIF-RESISTOR-1206  [1206]
R86  100  PASSIF-RESISTOR-1206  [1206]
R87  10k  PASSIF-RESISTOR-1206  [1206]
R88  100  PASSIF-RESISTOR-1206  [1206]
R89  100  PASSIF-RESISTOR-1206  [1206]
R90  100  PASSIF-RESISTOR-1206  [1206]
R91  10k  PASSIF-RESISTOR-1206  [1206]
R92  100  PASSIF-RESISTOR-1206  [1206]
R93  100  PASSIF-RESISTOR-1206  [1206]
R94  100  PASSIF-RESISTOR-1206  [1206]
R95  10k  PASSIF-RESISTOR-1206  [1206]
R96  100  PASSIF-RESISTOR-1206  [1206]
R97  100  PASSIF-RESISTOR-1206  [1206]
R98  100  PASSIF-RESISTOR-1206  [1206]
R99  10k  PASSIF-RESISTOR-1206  [1206]
R100  100  PASSIF-RESISTOR-1206  [1206]
R101  100  PASSIF-RESISTOR-1206  [1206]
R102  100  PASSIF-RESISTOR-1206  [1206]
R103  10k  PASSIF-RESISTOR-1206  [1206]
S7  ENCODER-RGB-SWITCH-NO_NUT  [ENCODER_LED_3]
S8  ENCODER-RGB-SWITCH-NO_NUT  [ENCODER_LED_3]
S9  ENCODER-RGB-SWITCH-NO_NUT  [ENCODER_LED_3]
S10  ENCODER-RGB-SWITCH-NO_NUT  [ENCODER_LED_3]
S11  ENCODER-RGB-SWITCH-NO_NUT  [ENCODER_LED_3]
S12  ENCODER-RGB-SWITCH-NO_NUT  [ENCODER_LED_3]
S13  ENCODER-RGB-SWITCH-NO_NUT  [ENCODER_LED_3]
S14  ENCODER-RGB-SWITCH-NO_NUT  [ENCODER_LED_3]

### Nets
3V3: C39.1 C40.+ C41.+ C42.1 C43.+ C44.+ C45.+ C46.+ C47.+ C48.+ C49.+ C50.+ C67.1 C68.1 C69.1 C70.1 C71.1 C72.1 C73.1 C74.1 CON_TFT_EXT.1 MCP_101.9(VDD) MCP_101.15(A0) MCP_101.17(A2) MCP_110.9(VDD) MCP_110.16(A1) MCP_110.17(A2) PX_BF.8(VCC) PX_HUMAN.8(VCC) PX_LATCH.8(VCC) PX_ONOFF.8(VCC) PX_PATTERN.8(VCC) PX_RANGE.8(VCC) PX_RATE.8(VCC) PX_SYNC.8(VCC) R44.2 R45.2 R46.2 R47.2 S7.5(+) S8.5(+) S9.5(+) S10.5(+) S11.5(+) S12.5(+) S13.5(+) S14.5(+) ; also sheet 1,2
GND: C39.2 C40.- C41.- C42.2 C43.- C44.- C45.- C46.- C47.- C48.- C49.- C50.- C51.1 C52.1 C53.1 C54.1 C55.1 C56.1 C57.1 C58.1 C59.1 C60.1 C61.1 C62.1 C63.1 C64.1 C65.1 C66.1 C67.2 C68.2 C69.2 C70.2 C71.2 C72.2 C73.2 C74.2 C75.2 C76.2 C77.2 C78.2 C79.2 C80.2 C81.2 C82.2 CON_TFT_EXT.7 MCP_101.10(VSS) MCP_101.16(A1) MCP_110.10(VSS) MCP_110.15(A0) PX_BF.4(GND) PX_HUMAN.4(GND) PX_LATCH.4(GND) PX_ONOFF.4(GND) PX_PATTERN.4(GND) PX_RANGE.4(GND) PX_RATE.4(GND) PX_SYNC.4(GND) R75.2 R79.2 R83.2 R87.2 R91.2 R95.2 R99.2 R103.2 S7.C S8.C S9.C S10.C S11.C S12.C S13.C S14.C ; also sheet 1,2
GPA0_41: MCP_101.21(GPA0) R71.1 R103.1 S14.3(SW)
GPA0_42: MCP_110.21(GPA0) R58.1 S12.A
GPA1_41: MCP_101.22(GPA1) R70.1 R99.1 S13.3(SW)
GPA1_42: MCP_110.22(GPA1) R59.1 S12.B
GPA2_41: MCP_101.23(GPA2) R60.1 S13.A
GPA2_42: MCP_110.23(GPA2) R56.1 S11.A
GPA3_41: MCP_101.24(GPA3) R61.1 S13.B
GPA3_42: MCP_110.24(GPA3) R57.1 S11.B
GPA4_5: R52.1 S9.A ; also sheet 2
GPA4_41: MCP_101.25(GPA4) R69.1 R95.1 S12.3(SW)
GPA4_42: MCP_110.25(GPA4) R68.1 R91.1 S11.3(SW)
GPA5_5: R53.1 S9.B ; also sheet 2
GPA5_41: CON_TFT_EXT.5 MCP_101.26(GPA5)
GPA5_42: MCP_110.26(GPA5) R54.1 S10.A
GPA6_5: R66.1 R83.1 S9.3(SW) ; also sheet 2
GPA6_41: CON_TFT_EXT.3 MCP_101.27(GPA6)
GPA6_42: MCP_110.27(GPA6) R55.1 S10.B
GPA7_5: R65.1 R79.1 S8.3(SW) ; also sheet 2
GPA7_41: CON_TFT_EXT.2 MCP_101.28(GPA7)
GPA7_42: MCP_110.28(GPA7) R67.1 R87.1 S10.3(SW)
GPB0_5: R51.1 S8.B ; also sheet 2
GPB0_41: CON_TFT_EXT.11 MCP_101.1(GPB0)
GPB0_42: MCP_110.1(GPB0) ; also sheet 2
GPB1_5: R50.1 S8.A ; also sheet 2
GPB1_41: CON_TFT_EXT.12 MCP_101.2(GPB1)
GPB1_42: MCP_110.2(GPB1) ; also sheet 2
GPB2_5: R64.1 R75.1 S7.3(SW) ; also sheet 2
GPB2_41: CON_TFT_EXT.10 MCP_101.3(GPB2)
GPB2_42: MCP_110.3(GPB2) ; also sheet 2
GPB3_5: R48.1 S7.A ; also sheet 2
GPB3_41: CON_TFT_EXT.8 MCP_101.4(GPB3)
GPB3_42: MCP_110.4(GPB3) ; also sheet 2
GPB4_5: R49.1 S7.B ; also sheet 2
GPB4_41: CON_TFT_EXT.6 MCP_101.5(GPB4)
GPB4_42: MCP_110.5(GPB4) ; also sheet 2
GPB5_41: CON_TFT_EXT.4 MCP_101.6(GPB5)
GPB5_42: MCP_110.6(GPB5) ; also sheet 2
GPB6_41: MCP_101.7(GPB6) R62.1 S14.A
GPB6_42: MCP_110.7(GPB6) ; also sheet 2
GPB7_41: MCP_101.8(GPB7) R63.1 S14.B
GPB7_42: MCP_110.8(GPB7) ; also sheet 2
GPIO_EXTI0: MCP_101.19(INTB) ; also sheet 1
GPIO_EXTI2: MCP_110.19(INTB) ; also sheet 1
GPIO_EXTI3: MCP_110.20(INTA) ; also sheet 1
GPIO_EXTI13: MCP_101.20(INTA) ; also sheet 1
I2C1_SCL: MCP_101.12(SCL) MCP_110.12(SCL) R45.1 R47.1 ; also sheet 1,2
I2C1_SDA: MCP_101.13(SDA) MCP_110.13(SDA) R44.1 R46.1 ; also sheet 1,2
N$4510: R96.2 S13.1(-R)
N$4511: R97.2 S13.2(-G)
N$4512: R98.2 S13.4(-B)
N$4513: PX_SYNC.1(OUT0) R96.1
N$4514: PX_SYNC.2(OUT1) R97.1
N$4515: PX_SYNC.3(OUT2) R98.1
N$4516: C63.2 R60.2
N$4517: C64.2 R61.2
N$4518: C81.1 R70.2
N$5782: R92.2 S12.1(-R)
N$5783: R93.2 S12.2(-G)
N$5784: R94.2 S12.4(-B)
N$5785: PX_RANGE.1(OUT0) R92.1
N$5786: PX_RANGE.2(OUT1) R93.1
N$5787: PX_RANGE.3(OUT2) R94.1
N$5788: C61.2 R58.2
N$5789: C62.2 R59.2
N$5790: C80.1 R69.2
N$6514: R88.2 S11.1(-R)
N$6515: R89.2 S11.2(-G)
N$6516: R90.2 S11.4(-B)
N$6517: PX_HUMAN.1(OUT0) R88.1
N$6518: PX_HUMAN.2(OUT1) R89.1
N$6519: PX_HUMAN.3(OUT2) R90.1
N$6520: C59.2 R56.2
N$6521: C60.2 R57.2
N$6522: C79.1 R68.2
N$7246: R84.2 S10.1(-R)
N$7247: R85.2 S10.2(-G)
N$7248: R86.2 S10.4(-B)
N$7249: PX_PATTERN.1(OUT0) R84.1
N$7250: PX_PATTERN.2(OUT1) R85.1
N$7251: PX_PATTERN.3(OUT2) R86.1
N$7252: C57.2 R54.2
N$7253: C58.2 R55.2
N$7254: C78.1 R67.2
N$7978: R80.2 S9.1(-R)
N$7979: R81.2 S9.2(-G)
N$7980: R82.2 S9.4(-B)
N$7981: PX_LATCH.1(OUT0) R80.1
N$7982: PX_LATCH.2(OUT1) R81.1
N$7983: PX_LATCH.3(OUT2) R82.1
N$7984: C55.2 R52.2
N$7985: C56.2 R53.2
N$7986: C77.1 R66.2
N$8161: R100.2 S14.1(-R)
N$8162: R101.2 S14.2(-G)
N$8163: R102.2 S14.4(-B)
N$8164: PX_RATE.1(OUT0) R100.1
N$8165: PX_RATE.2(OUT1) R101.1
N$8166: PX_RATE.3(OUT2) R102.1
N$8167: C65.2 R62.2
N$8168: C66.2 R63.2
N$8169: C82.1 R71.2
N$8527: R76.2 S8.1(-R)
N$8528: R77.2 S8.2(-G)
N$8529: R78.2 S8.4(-B)
N$8530: PX_BF.1(OUT0) R76.1
N$8531: PX_BF.2(OUT1) R77.1
N$8532: PX_BF.3(OUT2) R78.1
N$8533: C53.2 R50.2
N$8534: C54.2 R51.2
N$8535: C76.1 R65.2
N$8893: R72.2 S7.1(-R)
N$8894: R73.2 S7.2(-G)
N$8895: R74.2 S7.4(-B)
N$8896: PX_ONOFF.1(OUT0) R72.1
N$8897: PX_ONOFF.2(OUT1) R73.1
N$8898: PX_ONOFF.3(OUT2) R74.1
N$8899: C51.2 R48.2
N$8900: C52.2 R49.2
N$8901: C75.1 R64.2
PIXEL_75: PX_ONOFF.6(SDI) ; also sheet 2
PIXEL_81: CON_TFT_EXT.9 PX_RATE.5(SDO)
PIXEL_82: PX_RATE.6(SDI) PX_SYNC.5(SDO)
PIXEL_83: PX_RANGE.5(SDO) PX_SYNC.6(SDI)
PIXEL_84: PX_HUMAN.5(SDO) PX_RANGE.6(SDI)
PIXEL_85: PX_HUMAN.6(SDI) PX_PATTERN.5(SDO)
PIXEL_86: PX_LATCH.5(SDO) PX_PATTERN.6(SDI)
PIXEL_87: PX_BF.5(SDO) PX_LATCH.6(SDI)
PIXEL_88: PX_BF.6(SDI) PX_ONOFF.5(SDO)
RST: MCP_101.18(!RESET) MCP_110.18(!RESET) ; also sheet 1,2
Unconnected: PX_BF.7(TEST) PX_HUMAN.7(TEST) PX_LATCH.7(TEST) PX_ONOFF.7(TEST) PX_PATTERN.7(TEST) PX_RANGE.7(TEST) PX_RATE.7(TEST) PX_SYNC.7(TEST)

### Notes on the sheet
- RGB ENCODER 88
- RGB ENCODER 87
- RGB ENCODER 86
- MCP 41 & 42
- RGB ENCODER 85
- RGB ENCODER 84
- RGB ENCODER 83
- RGB ENCODER 82
- RGB ENCODER 81
- ARP

## Library data of the parts
0V/5V = stock-perso:PINHEADER-M04: Headers & Wire Housing, 1 Row, 4 Position
AIN = con-lstb:MA04-1: PIN HEADER; OC_FARNELL: unknown; OC_NEWARK: unknown
ANALOG DISCO MIDI = con-lstb:MA03-1: PIN HEADER; OC_FARNELL: unknown; OC_NEWARK: unknown
C1 C2 C6-C11 = MyComponents:C-US: SMD Multilayer Ceramic Capacitor; MOUSER: 80-C0805C104J5RAUTO
C3 C4 = MyComponents:CPOL-US: SMT Tantalum Capacitor; MOUSER: 581-TPSE477K010R0200
C5 = rcl:C-EU: CAPACITOR, European symbol; SPICEPREFIX: C
C12 C19-C39 C42 C51-C82 = stock-perso:PASSIF-CAP
C13-C18 C40 C41 C43-C50 = stock-perso:PASSIF-CPOL-US: SMT Tantalum Capacitor; MOUSER: 581-TPSE477K010R0200
CON_STH_BRD = MyComponents:MA10-2: Headers & Wire Housing, 2 Row, 20 Position; OC_FARNELL: unknown; OC_NEWARK: unknown
CON_TFT_EXT = con-lstb:MA06-2: PIN HEADER; OC_FARNELL: unknown; OC_NEWARK: unknown
F446 = STM32F446RCT7:STM32F446RCT7: 32 Bit Microcontroller, High Performance, ARM Cortex-M4, 180 MHz, 256 KB, 128 KB, 64, LQFP; AVAILABILITY: Unavailable; DESCRIPTION: ARM® Cortex®-M4 STM32F4 Microcontroller IC 32-Bit 180MHz 256KB (256K x 8) FLASH 64-LQFP (10x10); DIGIKEY-PURCHASE-URL: https://snapeda.com/shop?store=DigiKey&id=703054; MF: STMicroelectronics; MP: STM32F446RCT7; PACKAGE: LQFP-64 STMicroelectronics; PRICE: None
L1 = MyComponents:L-US: SMD Ferrite Bead; MOUSER: 963-CKP2012N1R0M-T
LD_3V LD_5V LD_GR = Passives:LED
MCP_101 MCP_110 MCP_111 = a_ranger_work:MCP23017
NRST = stock-perso:SWITCH-SKRKAEE020: Tactile Switches 3.9x2.9x2.0mm 160gf Packaging Temp 80oC Source: Datasheet <http://www.alps.com/prod/info/J/HTML/Tact/SurfaceMount/SKRK/SKRKAEE020.html>; DESCRIPTION: Tactile Switches 3.9x2.9x2.0mm 160gf Packaging Temp 80oC; HEIGHT: 2mm; MANUFACTURER_NAME: ALPS; MANUFACTURER_PART_NUMBER: SKRKAEE020; MOUSER_PART_NUMBER: 688-SKRKAEE020; MOUSER_PRICE-STOCK: https://www.mouser.co.uk/ProductDetail/ALPS/SKRKAEE020?qs=MrosSN5%252BUQW89XjXIp8Ugw%3D%3D
PX_BF PX_CHORUS PX_DELAY PX_DRIVE PX_HUMAN PX_LATCH PX_ONOFF PX_PATTERN PX_PORTA PX_RANGE PX_RATE PX_REVERB PX_SYNC = stock-perso:NEOPIXEL-TLC59731DR: 3-Channel, 8-Bit, PWM LED Driver with Single-Wire Interface (similaire à du neopixel) Source: Datasheet <http://www.ti.com/lit/gpn/tlc59731>; ARROW_PART_NUMBER: TLC59731DR; ARROW_PRICE-STOCK: https://www.arrow.com/en/products/tlc59731dr/texas-instruments; DESCRIPTION: 3-Channel, 8-Bit, PWM LED Driver with Single-Wire Interface; HEIGHT: 1.75mm; MANUFACTURER_NAME: Texas Instruments; MANUFACTURER_PART_NUMBER: TLC59731DR; MOUSER_PART_NUMBER: 595-TLC59731DR; MOUSER_PRICE-STOCK: https://www.mouser.co.uk/ProductDetail/Texas-Instruments/TLC59731DR?qs=s44pgLhgXQgiW%2FpyLmUsDA%3D%3D
R1-R6 = MyComponents:R-US: SMD Resistor; MOUSER: 660-RK73H2ATTDD1R00F
R7 R8 R44-R47 = 6P1_EVB:R-US_: RESISTOR, American symbol
R9-R43 R48-R103 = stock-perso:PASSIF-RESISTOR
REG = TLV75533PDBVR:TLV75533PDBVR: 500mA Low-IQ Small-Size Low-Dropout (LDO) Regulator 5-SOT-23 -40 to 125; AVAILABILITY: Unavailable; DESCRIPTION: Linear Voltage Regulator IC 1 Output 500mA SOT-23-5; MF: Texas Instruments; MP: TLV75533PDBVR; PACKAGE: SOT-23 Texas Instruments; PRICE: None
S2-S14 = stock-perso:ENCODER-RGB-SWITCH: Illuminated Rotary Encoder w/ RGB LED and select switch Encoders rotate similarly to potentiometers, but they’re different from potentiometers in that an encoder has full rotation without limits. They output gray code so that you can tell how much and in which direction the encoder has been turned. This encoder includes an RGB LED and a push-down select switch. Part #: Top Up EC12PLRGBSDVBF-D <http://top-up.so-buy.com/front/bin/ptdetail.phtml?Part=EC12PLRGBSDVBF-D> SparkFun Products Rotary Encoder - Illuminated (RGB) <https://www.sparkfun.com/products/10982> (COM-10982); PROD_ID: RES-14168
STLINK = MyComponents:MA03-2: Headers & Wire Housing, 2 Row, 6 Position; MOUSER: 649-75867-331LF